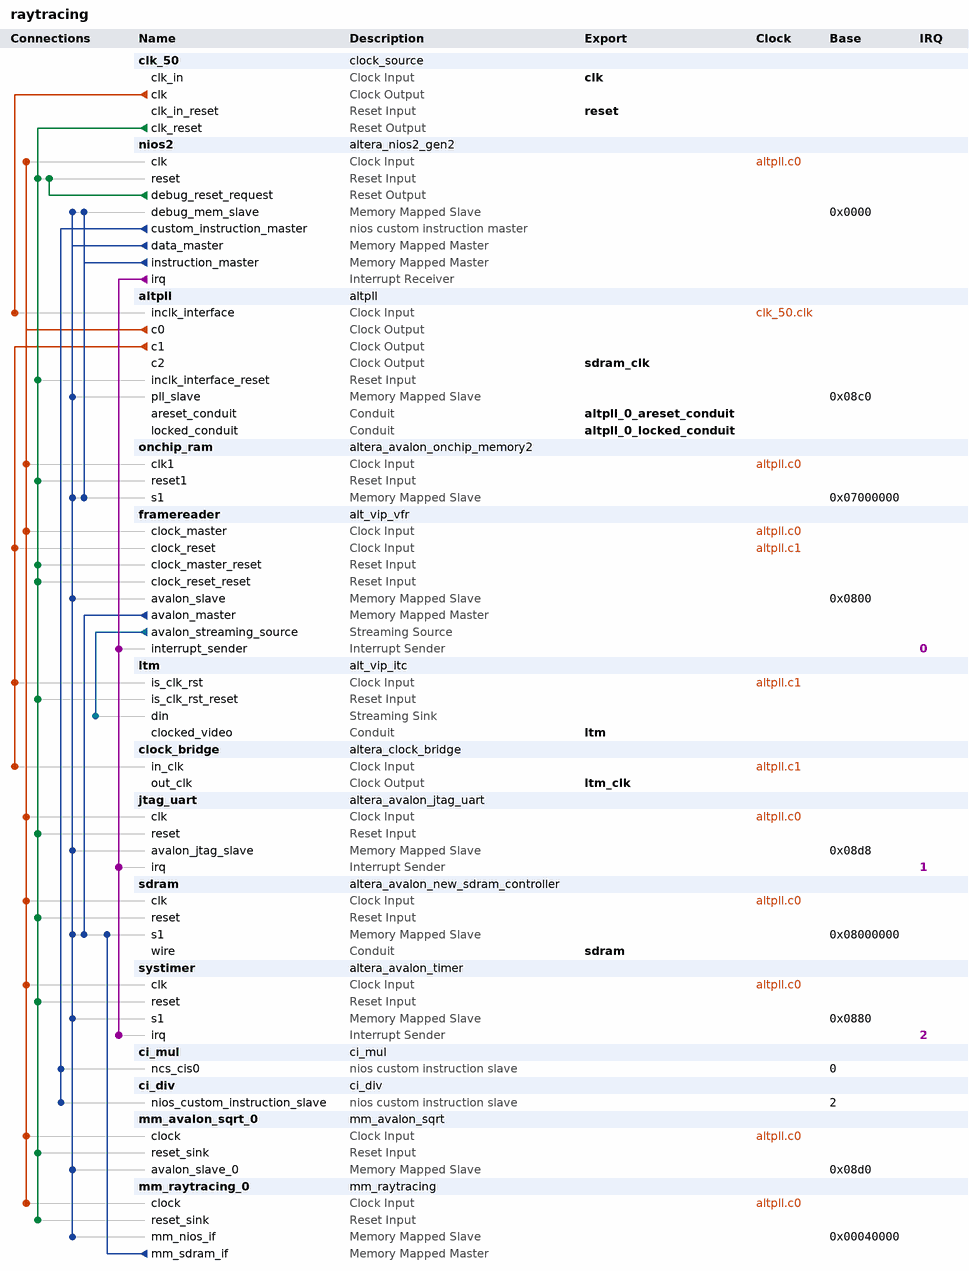
[diagram p0: system contents]
# Platform Designer (Qsys) system raytracing, Cyclone IV E EP4CE10E22A7
# Parameters at their usual value, and those the tool derives, are not listed.
package require -exact qsys 16.0
create_system raytracing
set_project_property DEVICE_FAMILY {Cyclone IV E}
set_project_property DEVICE EP4CE10E22A7

add_instance clk_50 clock_source 16.0
set_instance_parameter_value clk_50 clockFrequency 50000000

add_instance nios2 altera_nios2_gen2 16.0
set_instance_parameter_value nios2 dcache_size 16384
set_instance_parameter_value nios2 dividerType srt2
set_instance_parameter_value nios2 exceptionSlave onchip_ram.s1
set_instance_parameter_value nios2 icache_size 8192
set_instance_parameter_value nios2 impl Fast
set_instance_parameter_value nios2 resetSlave onchip_ram.s1

add_instance altpll altpll 16.0
set_instance_parameter_value altpll CLK0_DIVIDE_BY 1
set_instance_parameter_value altpll CLK0_MULTIPLY_BY 2
set_instance_parameter_value altpll CLK1_DIVIDE_BY 2
set_instance_parameter_value altpll CLK1_DUTY_CYCLE 50
set_instance_parameter_value altpll CLK1_MULTIPLY_BY 1
set_instance_parameter_value altpll CLK1_PHASE_SHIFT 0
set_instance_parameter_value altpll CLK2_DIVIDE_BY 1
set_instance_parameter_value altpll CLK2_DUTY_CYCLE 50
set_instance_parameter_value altpll CLK2_MULTIPLY_BY 2
set_instance_parameter_value altpll CLK2_PHASE_SHIFT -2500
set_instance_parameter_value altpll INCLK0_INPUT_FREQUENCY 20000
set_instance_parameter_value altpll PORT_ARESET PORT_USED
set_instance_parameter_value altpll PORT_LOCKED PORT_USED
set_instance_parameter_value altpll PORT_clk1 PORT_USED
set_instance_parameter_value altpll PORT_clk2 PORT_USED
set_instance_parameter_value altpll PORT_clk3 PORT_UNUSED

add_instance onchip_ram altera_avalon_onchip_memory2 16.0
set_instance_parameter_value onchip_ram dataWidth 32
set_instance_parameter_value onchip_ram dualPort false
set_instance_parameter_value onchip_ram initMemContent true
set_instance_parameter_value onchip_ram initializationFileName onchip_mem.hex
set_instance_parameter_value onchip_ram memorySize 153600

add_instance framereader alt_vip_vfr 14.0
set_instance_parameter_value framereader MAX_IMAGE_HEIGHT 480
set_instance_parameter_value framereader MAX_IMAGE_WIDTH 800
set_instance_parameter_value framereader MEM_PORT_WIDTH 32
set_instance_parameter_value framereader NUMBER_OF_CHANNELS_IN_PARALLEL 3

add_instance ltm alt_vip_itc 14.0
set_instance_parameter_value ltm CLOCKS_ARE_SAME 1
set_instance_parameter_value ltm FIFO_DEPTH 1024
set_instance_parameter_value ltm H_ACTIVE_PIXELS 800
set_instance_parameter_value ltm H_BACK_PORCH 216
set_instance_parameter_value ltm H_FRONT_PORCH 40
set_instance_parameter_value ltm H_SYNC_LENGTH 1
set_instance_parameter_value ltm NUMBER_OF_COLOUR_PLANES 3
set_instance_parameter_value ltm THRESHOLD 1023
set_instance_parameter_value ltm V_ACTIVE_LINES 480
set_instance_parameter_value ltm V_BACK_PORCH 35
set_instance_parameter_value ltm V_FRONT_PORCH 10
set_instance_parameter_value ltm V_SYNC_LENGTH 1

add_instance clock_bridge altera_clock_bridge 16.0
set_instance_parameter_value clock_bridge DERIVED_CLOCK_RATE 25000000
set_instance_parameter_value clock_bridge EXPLICIT_CLOCK_RATE 0

add_instance jtag_uart altera_avalon_jtag_uart 16.0
set_instance_parameter_value jtag_uart simInteractiveOptions NO_INTERACTIVE_WINDOWS

add_instance sdram altera_avalon_new_sdram_controller 16.0
set_instance_parameter_value sdram TAC 5.5
set_instance_parameter_value sdram TRCD 20.0
set_instance_parameter_value sdram TRP 20.0
set_instance_parameter_value sdram casLatency 3
set_instance_parameter_value sdram columnWidth 10
set_instance_parameter_value sdram dataWidth 32
set_instance_parameter_value sdram generateSimulationModel true
set_instance_parameter_value sdram model single_Micron_MT48LC4M32B2_7_chip
set_instance_parameter_value sdram numberOfBanks 4
set_instance_parameter_value sdram numberOfChipSelects 1
set_instance_parameter_value sdram powerUpDelay 100.0
set_instance_parameter_value sdram refreshPeriod 15.625
set_instance_parameter_value sdram rowWidth 13

add_instance systimer altera_avalon_timer 16.0
set_instance_parameter_value systimer counterSize 64
set_instance_parameter_value systimer period 42
set_instance_parameter_value systimer periodUnits SEC

add_instance ci_mul ci_mul 1.0

add_instance ci_div ci_div 1.0

add_instance mm_avalon_sqrt_0 mm_avalon_sqrt 1.0

add_instance mm_raytracing_0 mm_raytracing 1.0

# connections
add_connection altpll.c0 framereader.clock_master clock
add_connection altpll.c0 jtag_uart.clk clock
add_connection altpll.c0 mm_avalon_sqrt_0.clock clock
add_connection altpll.c0 mm_raytracing_0.clock clock
add_connection altpll.c0 nios2.clk clock
add_connection altpll.c0 onchip_ram.clk1 clock
add_connection altpll.c0 sdram.clk clock
add_connection altpll.c0 systimer.clk clock
add_connection altpll.c1 clock_bridge.in_clk clock
add_connection altpll.c1 framereader.clock_reset clock
add_connection altpll.c1 ltm.is_clk_rst clock
add_connection clk_50.clk altpll.inclk_interface clock
add_connection clk_50.clk_reset altpll.inclk_interface_reset reset
add_connection clk_50.clk_reset framereader.clock_master_reset reset
add_connection clk_50.clk_reset framereader.clock_reset_reset reset
add_connection clk_50.clk_reset jtag_uart.reset reset
add_connection clk_50.clk_reset ltm.is_clk_rst_reset reset
add_connection clk_50.clk_reset mm_avalon_sqrt_0.reset_sink reset
add_connection clk_50.clk_reset mm_raytracing_0.reset_sink reset
add_connection clk_50.clk_reset nios2.reset reset
add_connection clk_50.clk_reset onchip_ram.reset1 reset
add_connection clk_50.clk_reset sdram.reset reset
add_connection clk_50.clk_reset systimer.reset reset
add_connection nios2.debug_reset_request nios2.reset reset
add_connection framereader.avalon_master sdram.s1 avalon
set_connection_parameter_value framereader.avalon_master/sdram.s1 baseAddress 0x08000000
add_connection mm_raytracing_0.mm_sdram_if sdram.s1 avalon
set_connection_parameter_value mm_raytracing_0.mm_sdram_if/sdram.s1 baseAddress 0x08000000
add_connection nios2.data_master altpll.pll_slave avalon
set_connection_parameter_value nios2.data_master/altpll.pll_slave baseAddress 0x08c0
add_connection nios2.data_master framereader.avalon_slave avalon
set_connection_parameter_value nios2.data_master/framereader.avalon_slave baseAddress 0x0800
add_connection nios2.data_master jtag_uart.avalon_jtag_slave avalon
set_connection_parameter_value nios2.data_master/jtag_uart.avalon_jtag_slave baseAddress 0x08d8
add_connection nios2.data_master mm_avalon_sqrt_0.avalon_slave_0 avalon
set_connection_parameter_value nios2.data_master/mm_avalon_sqrt_0.avalon_slave_0 baseAddress 0x08d0
add_connection nios2.data_master mm_raytracing_0.mm_nios_if avalon
set_connection_parameter_value nios2.data_master/mm_raytracing_0.mm_nios_if baseAddress 0x00040000
add_connection nios2.data_master nios2.debug_mem_slave avalon
set_connection_parameter_value nios2.data_master/nios2.debug_mem_slave baseAddress 0x0000
add_connection nios2.data_master onchip_ram.s1 avalon
set_connection_parameter_value nios2.data_master/onchip_ram.s1 baseAddress 0x07000000
add_connection nios2.data_master sdram.s1 avalon
set_connection_parameter_value nios2.data_master/sdram.s1 baseAddress 0x08000000
add_connection nios2.data_master systimer.s1 avalon
set_connection_parameter_value nios2.data_master/systimer.s1 baseAddress 0x0880
add_connection nios2.instruction_master nios2.debug_mem_slave avalon
set_connection_parameter_value nios2.instruction_master/nios2.debug_mem_slave baseAddress 0x0000
add_connection nios2.instruction_master onchip_ram.s1 avalon
set_connection_parameter_value nios2.instruction_master/onchip_ram.s1 baseAddress 0x07000000
add_connection framereader.avalon_streaming_source ltm.din avalon_streaming
add_connection nios2.irq framereader.interrupt_sender interrupt
set_connection_parameter_value nios2.irq/framereader.interrupt_sender irqNumber 0
add_connection nios2.irq jtag_uart.irq interrupt
set_connection_parameter_value nios2.irq/jtag_uart.irq irqNumber 1
add_connection nios2.irq systimer.irq interrupt
set_connection_parameter_value nios2.irq/systimer.irq irqNumber 2
add_connection nios2.custom_instruction_master ci_div.nios_custom_instruction_slave nios_custom_instruction
set_connection_parameter_value nios2.custom_instruction_master/ci_div.nios_custom_instruction_slave CIName ci_div
set_connection_parameter_value nios2.custom_instruction_master/ci_div.nios_custom_instruction_slave baseAddress 2
add_connection nios2.custom_instruction_master ci_mul.ncs_cis0 nios_custom_instruction
set_connection_parameter_value nios2.custom_instruction_master/ci_mul.ncs_cis0 CIName ci_mul_0
set_connection_parameter_value nios2.custom_instruction_master/ci_mul.ncs_cis0 baseAddress 0

# exported interfaces
add_interface altpll_0_areset_conduit conduit end
set_interface_property altpll_0_areset_conduit EXPORT_OF altpll.areset_conduit
add_interface altpll_0_locked_conduit conduit end
set_interface_property altpll_0_locked_conduit EXPORT_OF altpll.locked_conduit
add_interface clk clock sink
set_interface_property clk EXPORT_OF clk_50.clk_in
add_interface ltm conduit end
set_interface_property ltm EXPORT_OF ltm.clocked_video
add_interface ltm_clk clock source
set_interface_property ltm_clk EXPORT_OF clock_bridge.out_clk
add_interface reset reset sink
set_interface_property reset EXPORT_OF clk_50.clk_in_reset
add_interface sdram conduit end
set_interface_property sdram EXPORT_OF sdram.wire
add_interface sdram_clk clock source
set_interface_property sdram_clk EXPORT_OF altpll.c2

set_interconnect_requirement {$system} qsys_mm.clockCrossingAdapter HANDSHAKE
set_interconnect_requirement {$system} qsys_mm.enableEccProtection FALSE
set_interconnect_requirement {$system} qsys_mm.insertDefaultSlave FALSE
set_interconnect_requirement {$system} qsys_mm.maxAdditionalLatency 1

save_system raytracing.qsys
